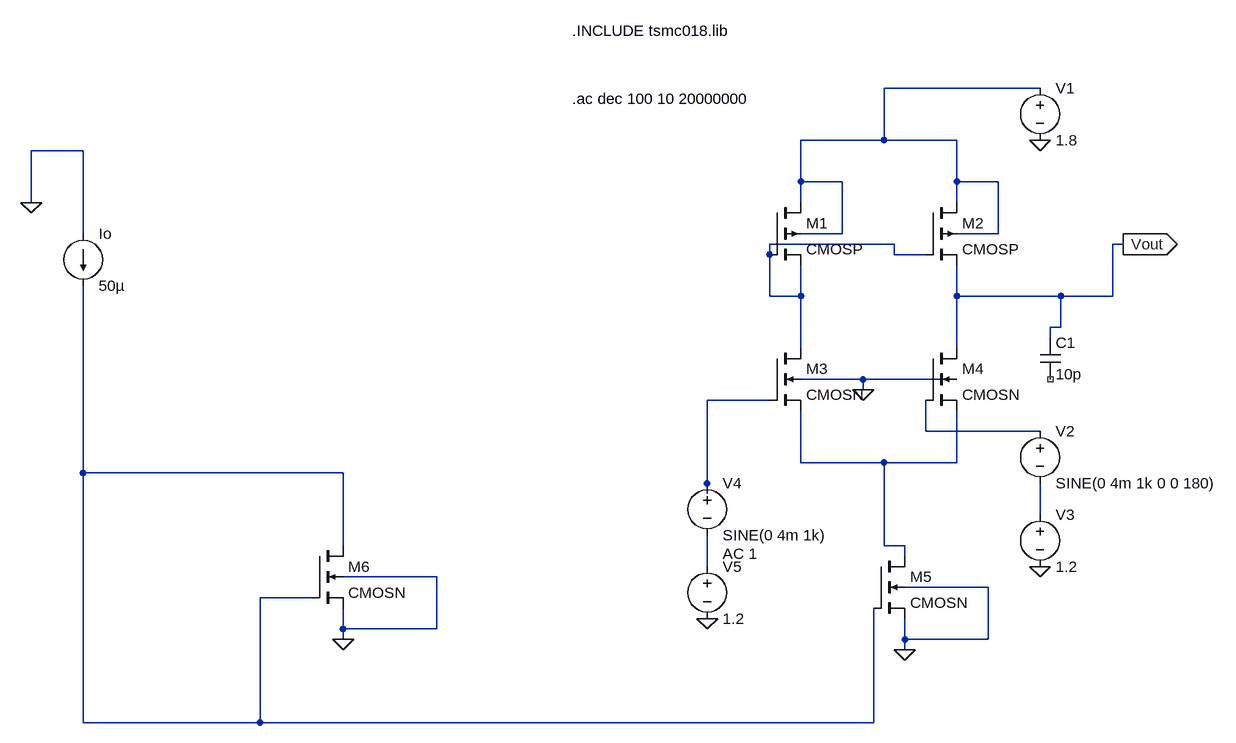
[diagram p0: schematic Exp-9.asc]
Exp-9.asc, the LTspice schematic file:
Version 4
SHEET 1 880 888
WIRE 448 -96 208 -96
WIRE 208 -16 208 -96
WIRE 208 -16 80 -16
WIRE 320 -16 208 -16
WIRE -1024 0 -1104 0
WIRE 80 48 80 -16
WIRE 144 48 80 48
WIRE 320 48 320 -16
WIRE 384 48 320 48
WIRE -1104 80 -1104 0
WIRE 80 80 80 48
WIRE 320 80 320 48
WIRE -1024 128 -1024 0
WIRE 144 128 144 48
WIRE 144 128 80 128
WIRE 384 128 384 48
WIRE 384 128 320 128
WIRE 224 144 32 144
WIRE 576 144 560 144
WIRE 32 160 32 144
WIRE 224 160 224 144
WIRE 272 160 224 160
WIRE 32 224 32 160
WIRE 80 224 80 176
WIRE 80 224 32 224
WIRE 320 224 320 176
WIRE 480 224 320 224
WIRE 560 224 560 144
WIRE 560 224 480 224
WIRE 480 272 480 224
WIRE 480 272 464 272
WIRE 464 288 464 272
WIRE 80 304 80 224
WIRE 320 304 320 224
WIRE 176 352 80 352
WIRE 320 352 176 352
WIRE 176 368 176 352
WIRE 32 384 -64 384
WIRE 272 432 272 384
WIRE 448 432 272 432
WIRE 80 480 80 400
WIRE 208 480 80 480
WIRE 320 480 320 400
WIRE 320 480 208 480
WIRE -1024 496 -1024 208
WIRE -624 496 -1024 496
WIRE -64 512 -64 384
WIRE -64 528 -64 512
WIRE 448 560 448 512
WIRE -624 608 -624 496
WIRE 208 608 208 480
WIRE 240 608 208 608
WIRE 240 624 240 608
WIRE -64 640 -64 592
WIRE -480 656 -624 656
WIRE 368 672 240 672
WIRE -672 688 -752 688
WIRE -624 736 -624 704
WIRE -480 736 -480 656
WIRE -480 736 -624 736
WIRE -624 752 -624 736
WIRE 240 752 240 720
WIRE 368 752 368 672
WIRE 368 752 240 752
WIRE 240 768 240 752
WIRE -1024 880 -1024 496
WIRE -752 880 -752 688
WIRE -752 880 -1024 880
WIRE 192 880 192 704
WIRE 192 880 -752 880
FLAG 448 -16 0
FLAG 176 368 0
FLAG 576 144 Vout
IOPIN 576 144 Out
FLAG 448 640 0
FLAG -64 720 0
FLAG -624 752 0
FLAG 240 768 0
FLAG -1104 80 0
SYMBOL cmosp 32 80 R0
SYMATTR InstName M1
SYMATTR Value2 l=180n w=800n
SYMBOL cmosp 272 80 R0
SYMATTR InstName M2
SYMATTR Value2 l=180n w=800n
SYMBOL cmosn 32 304 R0
SYMATTR InstName M3
SYMATTR Value2 l=180n w=400n
SYMBOL cmosn 272 304 R0
SYMATTR InstName M4
SYMATTR Value2 l=180n w=400n
SYMBOL voltage 448 -112 R0
WINDOW 123 0 0 Left 0
WINDOW 39 0 0 Left 0
SYMATTR InstName V1
SYMATTR Value 1.8
SYMBOL cap 448 288 R0
SYMATTR InstName C1
SYMATTR Value 10p
SYMBOL voltage 448 416 R0
WINDOW 123 0 0 Left 0
WINDOW 39 0 0 Left 0
SYMATTR InstName V2
SYMATTR Value SINE(0 4m 1k 0 0 180)
SYMBOL voltage 448 544 R0
WINDOW 123 0 0 Left 0
WINDOW 39 0 0 Left 0
SYMATTR InstName V3
SYMATTR Value 1.2
SYMBOL voltage -64 496 R0
WINDOW 123 24 124 Left 2
WINDOW 39 0 0 Left 0
SYMATTR InstName V4
SYMATTR Value SINE(0 4m 1k)
SYMATTR Value2 AC 1
SYMBOL voltage -64 624 R0
WINDOW 123 0 0 Left 0
WINDOW 39 0 0 Left 0
SYMATTR InstName V5
SYMATTR Value 1.2
SYMBOL cmosn 192 624 R0
SYMATTR InstName M5
SYMATTR Value2 l=180n w=400n
SYMBOL cmosn -672 608 R0
SYMATTR InstName M6
SYMATTR Value2 l=180n w=400n
SYMBOL current -1024 128 R0
WINDOW 123 0 0 Left 0
WINDOW 39 0 0 Left 0
SYMATTR InstName Io
SYMATTR Value 50µ
TEXT -272 -80 Left 2 !.ac dec 100 10 20000000
TEXT -272 -184 Left 2 !.INCLUDE tsmc018.lib

The netlist it stands for:
* Exp-9.asc
M1 N001 N002 N002 N001 CMOSP l=180n w=800n
M2 N001 N002 Vout N001 CMOSP l=180n w=800n
M3 N002 N003 N005 0 CMOSN l=180n w=400n
M4 Vout N004 N005 0 CMOSN l=180n w=400n
V1 N001 0 1.8
C1 Vout NC_01 10p
V2 N004 N007 SINE(0 4m 1k 0 0 180)
V3 N007 0 1.2
V4 N003 N008 SINE(0 4m 1k) AC 1
V5 N008 0 1.2
M5 N005 N006 0 0 CMOSN l=180n w=400n
M6 N006 N006 0 0 CMOSN l=180n w=400n
Io 0 N006 50µ
.model NMOS NMOS
.model PMOS PMOS
.lib standard.mos
.ac dec 100 10 20000000
.INCLUDE tsmc018.lib
.backanno
.end